# EAGLE schematic Gesamtschaltplan (EAGLE 7.5.0)
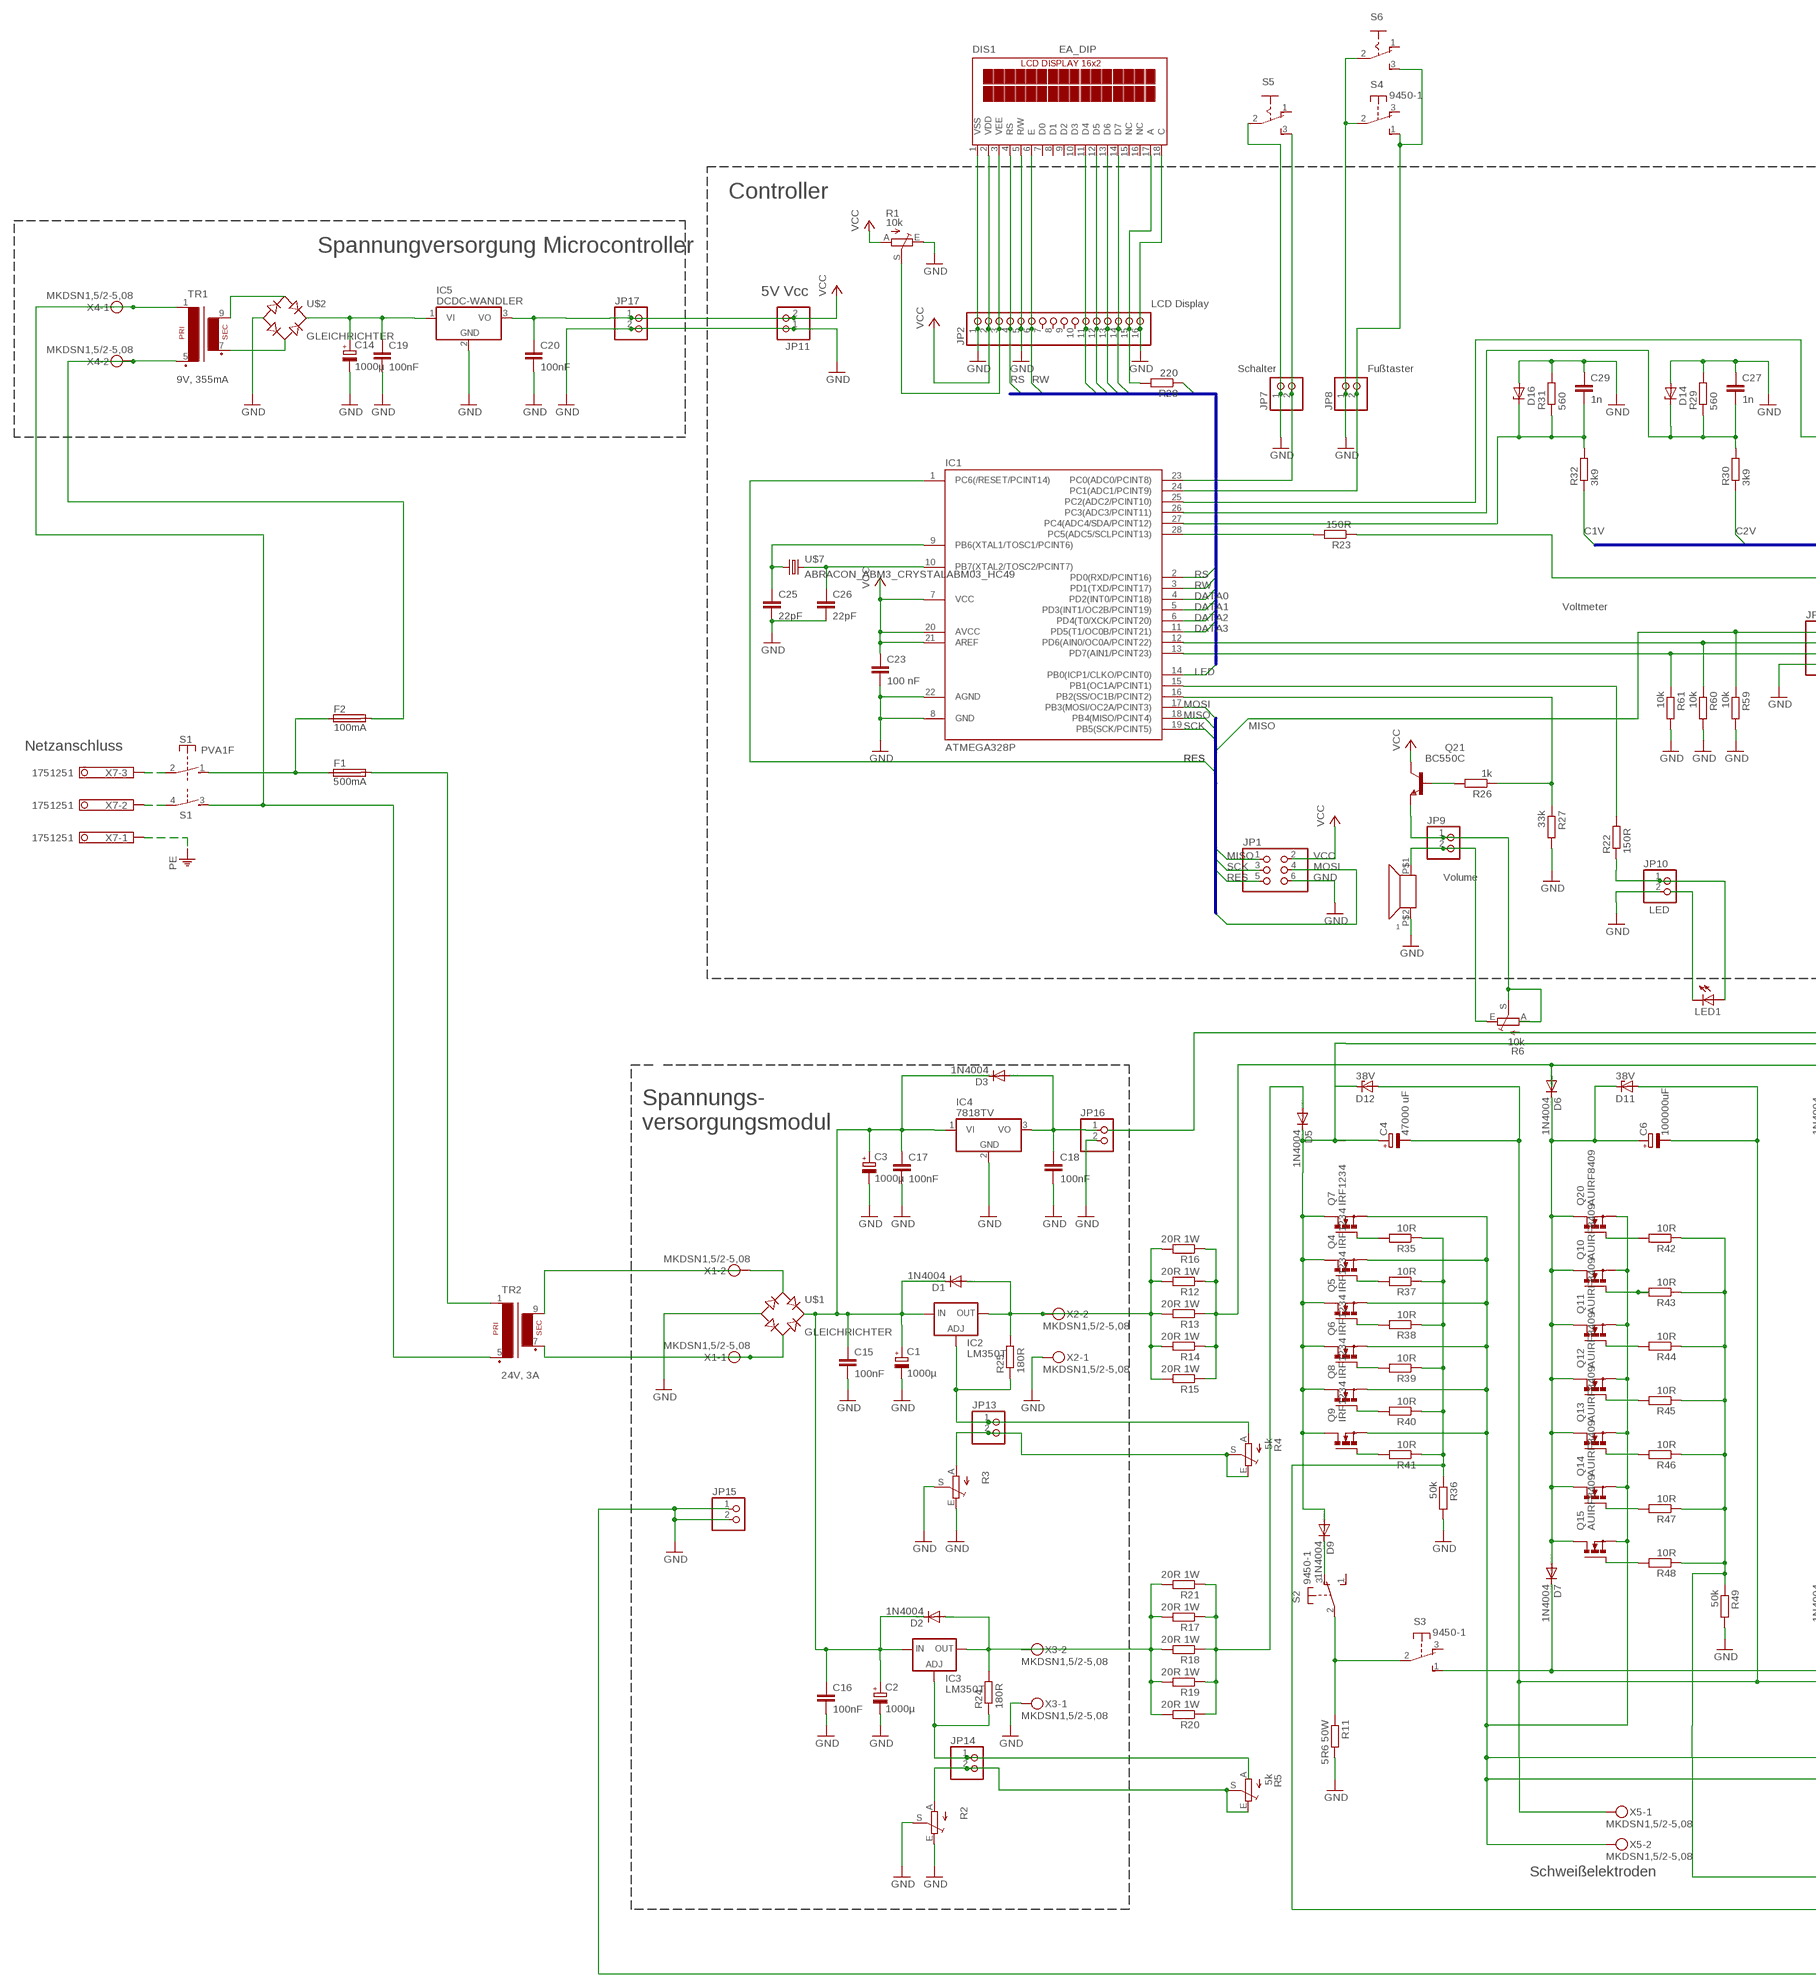
[diagram p0: schematic, sheet 1, part 1 of 2]
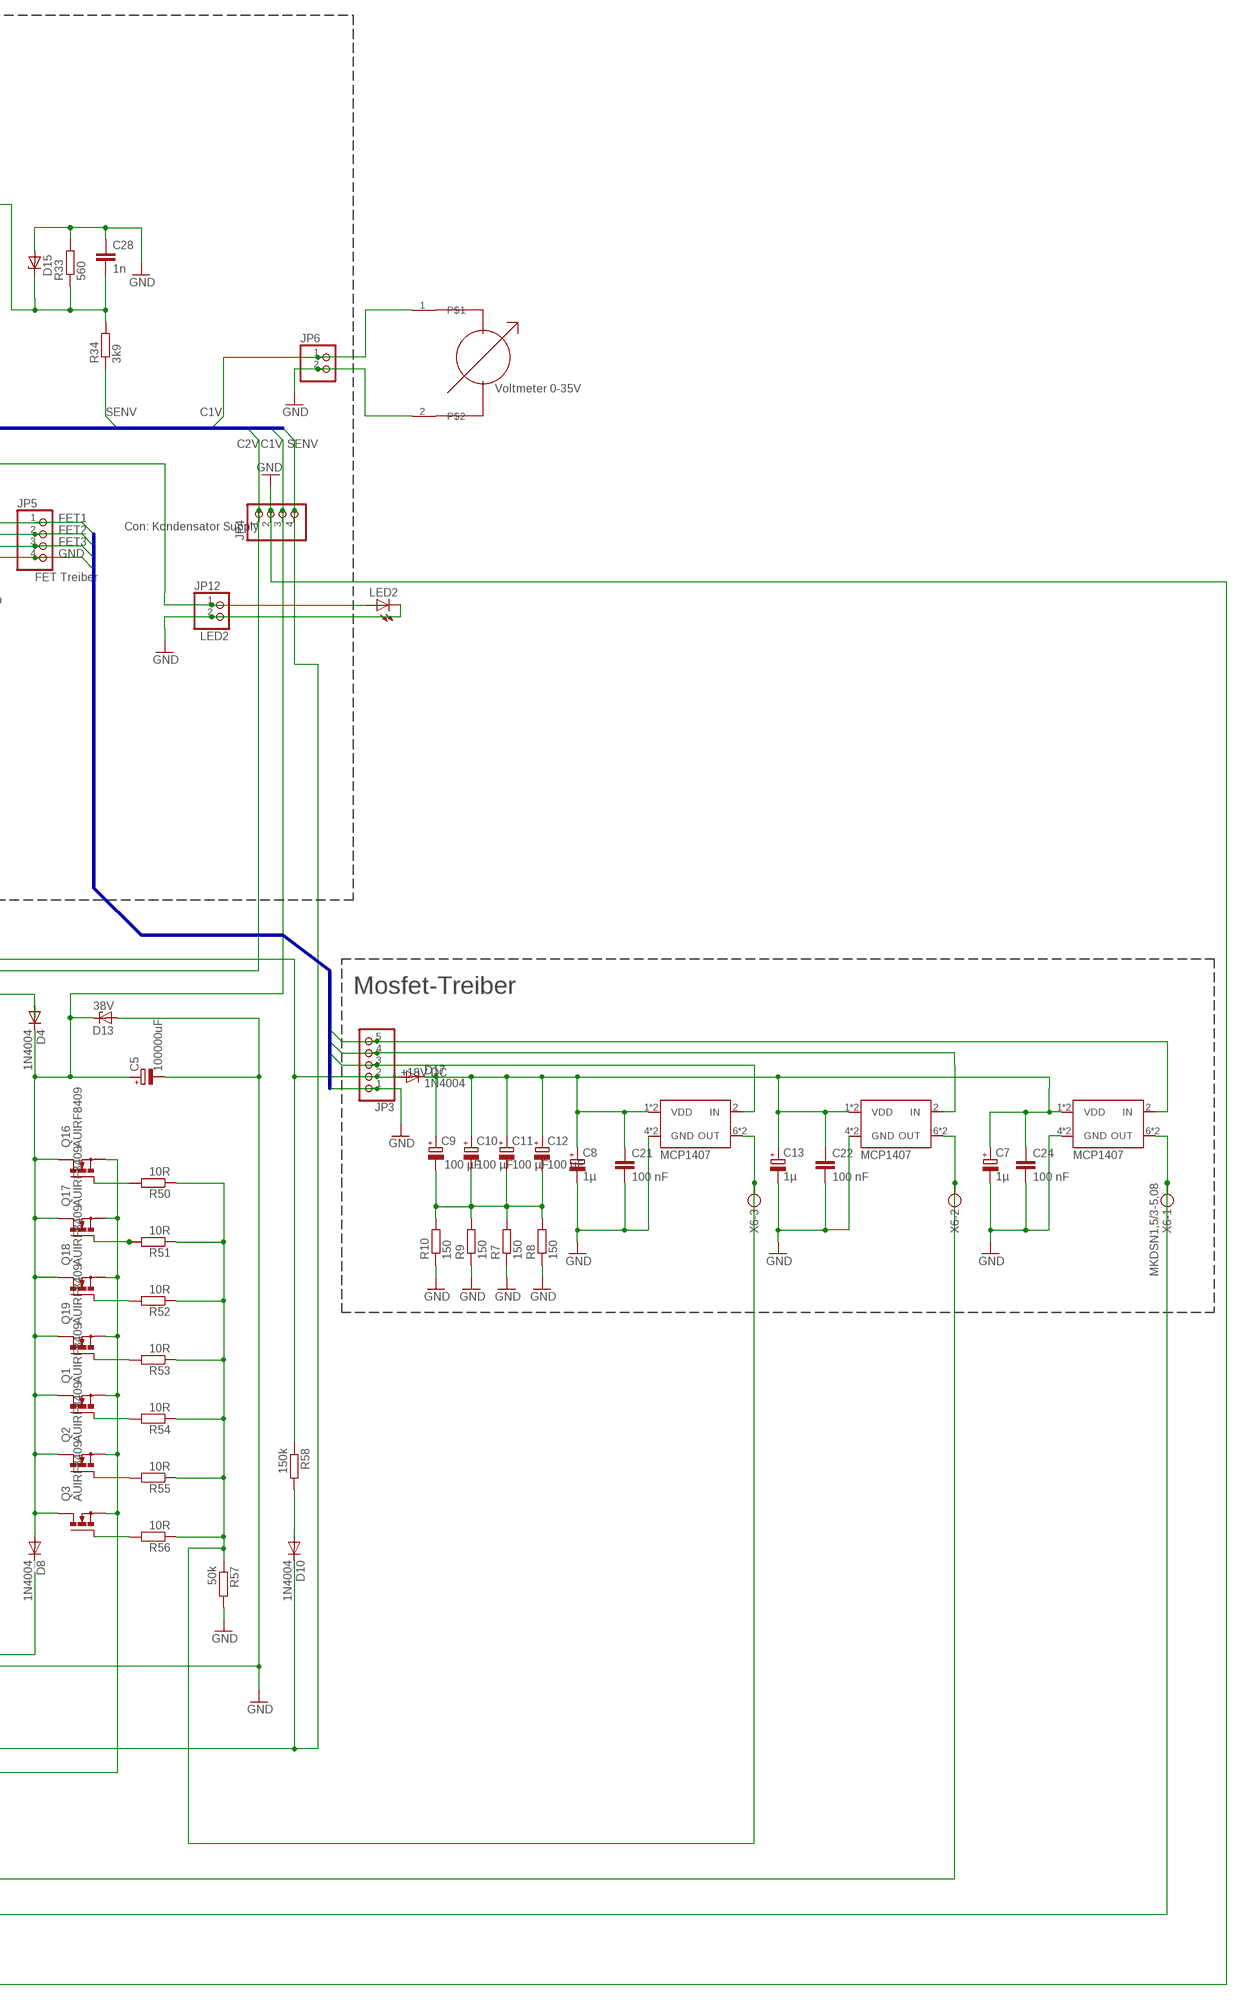
[diagram p1: schematic, sheet 1, part 2 of 2]

## Parts
1  SUMMER4  [PIEZO-INDIKATOR-KPMG]
C1  1000µ  CPOL-EUE5-13  [E5-13]
C2  1000µ  CPOL-EUE5-13  [E5-13]
C3  1000µ  CPOL-EUE5-13  [E5-13]
C4  47000 uF  CPOL-EUE5-9VAXIAL  [E5R]
C5  100000uF  CPOL-EUE5-9VAXIAL  [E5R]
C6  100000uF  CPOL-EUE5-9VAXIAL  [E5R]
C7  1µ  CPOL-EUE5-8.5  [E5-8,5]
C8  1µ  CPOL-EUE5-8.5  [E5-8,5]
C9  100 µF  CPOL-EUE2.5-7  [E2,5-7]
C10  100 µF  CPOL-EUE2.5-7  [E2,5-7]
C11  100 µF  CPOL-EUE2.5-7  [E2,5-7]
C12  100 µF  CPOL-EUE2.5-7  [E2,5-7]
C13  1µ  CPOL-EUE5-8.5  [E5-8,5]
C14  1000µ  CPOL-EUE3.5-8  [E3,5-8]
C15  100nF  C-EUC0805  [C0805]
C16  100nF  C-EUC0805  [C0805]
C17  100nF  C-EUC0805  [C0805]
C18  100nF  C-EUC0805  [C0805]
C19  100nF  C-EUC0805  [C0805]
C20  100nF  C-EUC0805  [C0805]
C21  100 nF  C-EUC0603  [C0603]
C22  100 nF  C-EUC0603  [C0603]
C23  100 nF  C-EUC0603  [C0603]
C24  100 nF  C-EUC0603  [C0603]
C25  22pF  C-EUC0603K  [C0603K]
C26  22pF  C-EUC0603K  [C0603K]
C27  1n  C-EUC0603K  [C0603K]
C28  1n  C-EUC0603K  [C0603K]
C29  1n  C-EUC0603K  [C0603K]
D1  1N4004  [DO41-10]
D2  1N4004  [DO41-10]
D3  1N4004  [DO41-10]
D4  1N4004  [DO41-10]
D5  1N4004  [DO41-10]
D6  1N4004  [DO41-10]
D7  1N4004  [DO41-10]
D8  1N4004  [DO41-10]
D9  1N4004  [DO41-10]
D10  1N4004  [DO41-10]
D11  38V  ZENER-DIODEC1702-15  [C1702-15]
D12  38V  ZENER-DIODEC1702-15  [C1702-15]
D13  38V  ZENER-DIODEC1702-15  [C1702-15]
D14  ZENER-DIODESOT23  [SOT23]
D15  ZENER-DIODESOT23  [SOT23]
D16  ZENER-DIODESOT23  [SOT23]
D17  1N4004  [DO41-10]
DIS1  EA_DIP  [EA_DIP]
F1  500mA  GSH15  [GSH15]
F2  100mA  GSH15  [GSH15]
IC1  ATMEGA328P  MEGA48/88/168-PU  [DIL28-3]
IC2  LM350T  LM317TS  [317TS]
IC3  LM350T  LM317TS  [317TS]
IC4  7818TV  7805TV  [TO220V]
IC5  DCDC-WANDLER  [TRACOPOWER-DCDCWANDER-TSR1]
JP1  PINHD-2X3  [2X03]
JP2  PINHD-1X16  [1X16]
JP3  PINHD-1X5  [1X05]
JP4  PINHD-1X4  [1X04]
JP5  PINHD-1X4  [1X04]
JP6  PINHD-1X2  [1X02]
JP7  PINHD-1X2  [1X02]
JP8  PINHD-1X2  [1X02]
JP9  PINHD-1X2  [1X02]
JP10  PINHD-1X2  [1X02]
JP11  PINHD-1X2  [1X02]
JP12  PINHD-1X2  [1X02]
JP13  PINHD-1X2  [1X02]
JP14  PINHD-1X2  [1X02]
JP15  PINHD-1X2  [1X02]
JP16  PINHD-1X2  [1X02]
JP17  PINHD-1X2  [1X02]
LED1  LED5MM  [LED5MM]
LED2  LED5MM  [LED5MM]
Q1  AUIRF8409  PMOSFET_NTO220BH  [TO220BH]
Q2  AUIRF8409  PMOSFET_NTO220BH  [TO220BH]
Q3  AUIRF8409  PMOSFET_NTO220BH  [TO220BH]
Q4  IRF1234  PMOSFET_NTO220BH  [TO220BH]
Q5  IRF1234  PMOSFET_NTO220BH  [TO220BH]
Q6  IRF1234  PMOSFET_NTO220BH  [TO220BH]
Q7  IRF1234  PMOSFET_NTO220BH  [TO220BH]
Q8  IRF1234  PMOSFET_NTO220BH  [TO220BH]
Q9  IRF1234  PMOSFET_NTO220BH  [TO220BH]
Q10  AUIRF8409  PMOSFET_NTO220BH  [TO220BH]
Q11  AUIRF8409  PMOSFET_NTO220BH  [TO220BH]
Q12  AUIRF8409  PMOSFET_NTO220BH  [TO220BH]
Q13  AUIRF8409  PMOSFET_NTO220BH  [TO220BH]
Q14  AUIRF8409  PMOSFET_NTO220BH  [TO220BH]
Q15  AUIRF8409  PMOSFET_NTO220BH  [TO220BH]
Q16  AUIRF8409  PMOSFET_NTO220BH  [TO220BH]
Q17  AUIRF8409  PMOSFET_NTO220BH  [TO220BH]
Q18  AUIRF8409  PMOSFET_NTO220BH  [TO220BH]
Q19  AUIRF8409  PMOSFET_NTO220BH  [TO220BH]
Q20  AUIRF8409  PMOSFET_NTO220BH  [TO220BH]
Q21  BC550C  [TO92-EBC]
R1  10k  TRIM_EU-PT10  [PT-10]
R2  TRIM_EU-PT10  [PT-10]
R3  TRIM_EU-PT10  [PT-10]
R4  5k  TRIM_EU-PT10  [PT-10]
R5  5k  TRIM_EU-PT10  [PT-10]
R6  10k  TRIM_EU-PT10  [PT-10]
R7  150  R-EU_0411/15  [0411/15]
R8  150  R-EU_0411/15  [0411/15]
R9  150  R-EU_0411/15  [0411/15]
R10  150  R-EU_0411/15  [0411/15]
R11  5R6 50W  R-EU_R1206  [R1206]
R12  20R 1W  R-EU_R1206  [R1206]
R13  20R 1W  R-EU_R1206  [R1206]
R14  20R 1W  R-EU_R1206  [R1206]
R15  20R 1W  R-EU_R1206  [R1206]
R16  20R 1W  R-EU_R1206  [R1206]
R17  20R 1W  R-EU_R1206  [R1206]
R18  20R 1W  R-EU_R1206  [R1206]
R19  20R 1W  R-EU_R1206  [R1206]
R20  20R 1W  R-EU_R1206  [R1206]
R21  20R 1W  R-EU_R1206  [R1206]
R22  150R  R-EU_R1206  [R1206]
R23  150R  R-EU_R1206  [R1206]
R24  180R  R-EU_R1206  [R1206]
R25  180R  R-EU_R1206  [R1206]
R26  1k  R-EU_R1206  [R1206]
R27  33k  R-EU_R1206  [R1206]
R28  220  R-EU_R1206  [R1206]
R29  560  R-EU_R1206  [R1206]
R30  3k9  R-EU_R1206  [R1206]
R31  560  R-EU_R1206  [R1206]
R32  3k9  R-EU_R1206  [R1206]
R33  560  R-EU_R1206  [R1206]
R34  3k9  R-EU_R1206  [R1206]
R35  10R  R-EU_R1206  [R1206]
R36  50k  R-EU_R1206  [R1206]
R37  10R  R-EU_R1206  [R1206]
R38  10R  R-EU_R1206  [R1206]
R39  10R  R-EU_R1206  [R1206]
R40  10R  R-EU_R1206  [R1206]
R41  10R  R-EU_R1206  [R1206]
R42  10R  R-EU_R1206  [R1206]
R43  10R  R-EU_R1206  [R1206]
R44  10R  R-EU_R1206  [R1206]
R45  10R  R-EU_R1206  [R1206]
R46  10R  R-EU_R1206  [R1206]
R47  10R  R-EU_R1206  [R1206]
R48  10R  R-EU_R1206  [R1206]
R49  50k  R-EU_R1206  [R1206]
R50  10R  R-EU_R1206  [R1206]
R51  10R  R-EU_R1206  [R1206]
R52  10R  R-EU_R1206  [R1206]
R53  10R  R-EU_R1206  [R1206]
R54  10R  R-EU_R1206  [R1206]
R55  10R  R-EU_R1206  [R1206]
R56  10R  R-EU_R1206  [R1206]
R57  50k  R-EU_R1206  [R1206]
R58  150k  R-EU_R1206  [R1206]
R59  10k  R-EU_R1206  [R1206]
R60  10k  R-EU_R1206  [R1206]
R61  10k  R-EU_R1206  [R1206]
S1  PVA1F  [PVA1F]
S2  9450-1  [9450-1]
S3  9450-1  [9450-1]
S4  9450-1  [9450-1]
S5  255SB  [255SB]
S6  255SB  [255SB]
TR1  EI38-1  [EI38-1]
TR2  EI38-1  [EI38-1]
U$1  GLEICHRICHTER  [KBPC1]
U$2  GLEICHRICHTER  [KBPC1]
U$3  VOLTMETER  [19560]
U$4  MCP1407MCP1407-DIL08  [DIL-08]
U$5  MCP1407MCP1407-DIL08  [DIL-08]
U$6  MCP1407MCP1407-DIL08  [DIL-08]
U$7  ABRACON_ABM3_CRYSTALABM03_HC49  [ABM03_HC49]
X1  MKDSN1,5/2-5,08  [MKDSN1,5/2-5,08]
X2  MKDSN1,5/2-5,08  [MKDSN1,5/2-5,08]
X3  MKDSN1,5/2-5,08  [MKDSN1,5/2-5,08]
X4  MKDSN1,5/2-5,08  [MKDSN1,5/2-5,08]
X5  MKDSN1,5/2-5,08  [MKDSN1,5/2-5,08]
X6  MKDSN1,5/3-5,08  [MKDSN1,5/3-5,08]
X7  1751251  [1751251]

## Nets
C1V: C5.+ D4.C D8.A D13.C JP4.3 JP6.1 Q1.D Q2.D Q3.D Q16.D Q17.D Q18.D Q19.D R32.1 U$3.1
C1V1: R17.1 R18.1 R19.1 R20.1 R21.1
C2V: JP4.1 R30.1
DATA0: DIS1.11(D4) IC1.4(PD2(INT0/PCINT18)) JP2.11
DATA1: DIS1.12(D5) IC1.5(PD3(INT1/OC2B/PCINT19)) JP2.12
DATA2: DIS1.13(D6) IC1.6(PD4(T0/XCK/PCINT20)) JP2.13
DATA3: DIS1.14(D7) IC1.11(PD5(T1/OC0B/PCINT21)) JP2.14
FET1: JP3.5 U$6.2(IN)
FET2: IC1.12(PD6(AIN0/OC0A/PCINT22)) JP3.4 JP5.2 R60.1 U$5.2(IN)
FET3: IC1.13(PD7(AIN1/PCINT23)) JP3.3 JP5.3 R61.1 U$4.2(IN)
GND: 1.P$2(+) C1.- C2.- C3.- C4.- C5.- C6.- C7.- C8.- C14.- C15.2 C16.2 C17.2 C18.2 C19.2 C20.2 C21.2 C23.2 C24.2 C25.2 C26.2 C27.1 C28.1 C29.1 D11.A D12.A D13.A D14.1(A) D15.1(A) D16.1(A) DIS1.1(VSS) DIS1.5(R/W) DIS1.18(C) IC1.8(GND) IC1.22(AGND) IC4.2(GND) IC5.2(GND) JP1.6 JP2.1 JP2.5 JP2.16 JP3.1 JP4.2 JP5.4 JP6.2 JP7.1 JP8.1 JP10.2 JP11.1 JP12.2 JP15.1 JP15.2 JP16.2 JP17.2 LED2.K(C) R1.E R2.E R2.S R3.E R3.S R7.1 R8.1 R9.1 R10.1 R11.2 R27.2 R29.2 R31.2 R33.2 R36.2 R49.2 R57.2 R59.2 R60.2 R61.2 S5.2(P) S6.2(P) U$1.- U$2.- U$3.2 U$4.4(GND) U$4.5(GND) U$6.4(GND) U$6.5(GND) X2.1 X3.1 X5.1
GND1: C13.- C22.2 U$5.4(GND) U$5.5(GND)
LED: IC1.14(PB0(ICP1/CLKO/PCINT0)) R28.1
MISO: IC1.18(PB4(MISO/PCINT4)) JP1.1 JP5.1 R59.1
MOSI: IC1.17(PB3(MOSI/OC2A/PCINT3)) JP1.4
N$1: JP12.1 LED2.A R23.1
N$2: IC1.28(PC5(ADC5/SCLPCINT13)) R23.2
N$3: D17.A JP3.2 R58.1
N$4: Q21.B R26.2
N$5: C29.2 D16.3(C) IC1.27(PC4(ADC4/SDA/PCINT12)) R31.1 R32.2
N$6: JP10.1 LED1.A R22.1
N$7: C27.2 D14.3(C) IC1.26(PC3(ADC3/PCINT11)) R29.1 R30.2
N$8: DIS1.3(VEE) JP2.3 R1.S
N$9: IC1.16(PB2(SS/OC1B/PCINT2)) R26.1 R27.1
N$10: IC1.23(PC0(ADC0/PCINT8)) JP7.2 S5.3(S)
N$11: LED1.K(C)
N$12: IC1.24(PC1(ADC1/PCINT9)) JP8.2 S4.1(S) S6.3(S)
N$13: 1.P$1(-) JP9.2 R6.E
N$14: D10.A R58.2
N$15: C4.+ D5.C D9.A D12.C Q4.D Q5.D Q6.D Q7.D Q8.D Q9.D
N$16: C9.- C10.- C11.- C12.- R7.2 R8.2 R9.2 R10.2
N$17: D5.A
N$18: C28.2 D15.3(C) IC1.25(PC2(ADC2/PCINT10)) R33.1 R34.2
N$19: S3.1(S)
N$20: IC2.1(ADJ) JP13.1 R4.A R25.1
N$21: D4.A D6.A R12.1 R13.1 R14.1 R15.1 R16.1
N$22: JP9.1 Q21.E R6.A R6.S
N$23: JP14.2 R2.A R5.E R5.S
N$24: U$1.AC1 X1.2
N$25: TR2.7(S3) U$1.AC2 X1.1
N$26: IC1.15(PB1(OC1A/PCINT1)) R22.2
N$27: C26.1 IC1.10(PB7(XTAL2/TOSC2/PCINT7)) U$7.2
N$28: C25.1 IC1.9(PB6(XTAL1/TOSC1/PCINT6)) U$7.1
N$29: JP13.2 R3.A R4.E R4.S
N$30: R11.1 S2.2(P) S3.2(P)
N$31: C7.+ C8.+ C9.+ C10.+ C11.+ C12.+ C13.+ C21.1 C22.1 C24.1 D17.C U$4.1(VDD) U$4.8(VDD) U$5.1(VDD) U$5.8(VDD) U$6.1(VDD) U$6.8(VDD)
N$35: D9.C S2.3(O)
N$36: C1.+ C2.+ C3.+ C15.1 C16.1 C17.1 D1.C D2.C D3.C IC2.3(IN) IC3.3(IN) IC4.1(VI) U$1.+
N$37: C18.1 D3.A IC4.3(VO) JP16.1
N$38: C14.+ C19.1 IC5.1(VI) U$2.+
N$39: S1.3(2:S) TR1.1 TR2.5(P2) X4.1
N$40: F2.2 TR1.5(P2) X4.2
N$41: TR1.7(S3) U$2.AC2
N$42: TR1.9(S4) U$2.AC1
N$43: Q7.G R35.2
N$44: Q4.G R37.2
N$45: Q5.G R38.2
N$46: S1.4(2:P) X7.2
N$47: DIS1.17(A) JP2.15 R28.2
N$48: TR2.9(S4)
N$49: S1.2(1:P) X7.3
N$50: F1.1 F2.1 S1.1(1:S)
N$51: F1.2 TR2.1
N$52: Q6.G R39.2
N$53: Q8.G R40.2
N$54: Q9.G R41.2
N$55: R35.1 R36.1 R37.1 R38.1 R39.1 R40.1 R41.1 U$6.6(OUT) U$6.7(OUT) X6.1
N$56: R17.2 R18.2 R19.2 R20.2 R21.2
N$57: D1.A IC2.2(OUT) R12.2 R13.2 R14.2 R15.2 R16.2 R25.2 X2.2
N$59: IC3.1(ADJ) JP14.1 R24.1
N$60: D2.A IC3.2(OUT) R24.2 X3.2
N$61: Q20.G R42.2
N$62: Q10.G R43.2
N$63: Q11.G R44.2
N$64: Q12.G R45.2
N$65: Q13.G R46.2
N$66: Q14.G R47.2
N$67: Q15.G R48.2
N$68: R42.1 R43.1 R44.1 R45.1 R46.1 R47.1 R48.1 R49.1 U$5.6(OUT) U$5.7(OUT) X6.2
N$69: C6.+ D6.C D7.A D11.C Q10.D Q11.D Q12.D Q13.D Q14.D Q15.D Q20.D
N$70: Q16.G R50.2
N$71: Q17.G R51.2
N$72: Q18.G R52.2
N$73: Q19.G R53.2
N$74: Q1.G R54.2
N$75: Q2.G R55.2
N$76: Q3.G R56.2
N$77: R50.1 R51.1 R52.1 R53.1 R54.1 R55.1 R56.1 R57.1 U$4.6(OUT) U$4.7(OUT) X6.3
PE: X7.1
RES: IC1.1(PC6(/RESET/PCINT14)) JP1.5
RS: DIS1.4(RS) IC1.2(PD0(RXD/PCINT16)) JP2.4
RW: DIS1.6(E) IC1.3(PD1(TXD/PCINT17)) JP2.6
SCK: IC1.19(PB5(SCK/PCINT5)) JP1.3
SENV: D10.C JP4.4 Q1.S Q2.S Q3.S Q4.S Q5.S Q6.S Q7.S Q8.S Q9.S Q10.S Q11.S Q12.S Q13.S Q14.S Q15.S Q16.S Q17.S Q18.S Q19.S Q20.S R34.1 X5.2
VCC: C20.1 C23.1 DIS1.2(VDD) IC1.7(VCC) IC1.20(AVCC) IC1.21(AREF) IC5.3(VO) JP1.2 JP2.2 JP11.2 JP17.1 Q21.C R1.A
Unconnected: D7.C D8.C DIS1.7(D0) DIS1.8(D1) DIS1.9(D2) DIS1.10(D3) DIS1.15(NC) DIS1.16(NC) JP2.7 JP2.8 JP2.9 JP2.10 R5.A S2.1(S) S3.3(O) S4.2(P) S4.3(O) S5.1(O) S6.1(O)

## Buses
DISPLAY:DATA[0..3],RS,RW,LED
ISP:MISO,MOSI,SCK,RES
VOLTAGEMEASURES:C1V,C2V,SENV
FET[1..3],GND

## Notes on the sheet
- Controller
- Spannungversorgung Microcontroller
- 5V Vcc
- LCD Display
- Schalter | Fußtaster
- 9V, 355mA
- Voltmeter 0-35V
- Voltmeter
- FET1 | Con: Kondensator Supply
- FET Treiber
- LED2
- Netzanschluss
- Volume
- LED
- Mosfet-Treiber
- Spannungs-
  versorgungsmodul
- +18V DC
- MCP1407 | MCP1407 | MCP1407
- 24V, 3A
- Schweißelektroden

## Library data of the parts
1 = 0liver:SUMMER: SUMMER BS 27HS :: Piezosummer https://www.reichelt.de/Signalakustik/SUMMER-BS-27HS/3/index.html?&ACTION=3&LA=446&GROUPID=6560&ARTICLE=35922
C1-C14 = rcl:CPOL-EU: POLARIZED CAPACITOR, European symbol
C15-C20 C27-C29 = rcl:C-EU: CAPACITOR, European symbol
C21-C26 = resistor:C-EU: CAPACITOR, European symbol
D1-D10 D17 = diode:1N4004: DIODE general purpose rectifier, 1 A
D11-D16 = diode:ZENER-DIODE: Z-Diode
DIS1 = display-lcd:EA_DIP: LCD-MODUL 2x16 - 6,68mm, INKL. KONTROLLER HD44780 Source: Data sheet <http://www.lcd-module.de/pdf/doma/dip162-d.pdf>
F1 F2 = fuse:GSH15: FUSE HOLDER grid 15mm, 19649 Wickmann; MPN: 64900001039; OC_FARNELL: 1271673; OC_NEWARK: 02P0318
IC1 = avr-6:MEGA48/88/168-PU
IC2 IC3 = v-reg:LM317TS: VOLTAGE REGULATOR
IC4 = linear:78*: Positive VOLTAGE REGULATOR Source: http://cache.national.com/ds/LM/LM78L05.pdf http://www.fairchildsemi.com/ds/LM/LM7805.pdf
IC5 = 0liver:DCDC-WANDLER
JP1 = pinhead:PINHD-2X3: PIN HEADER
JP2 = pinhead:PINHD-1X16: PIN HEADER
JP3 = pinhead:PINHD-1X5: PIN HEADER
JP4 JP5 = pinhead:PINHD-1X4: PIN HEADER
JP6-JP17 = pinhead:PINHD-1X2: PIN HEADER
LED1 LED2 = led:LED: LED OSRAM: - CHIPLED LG R971, LG N971, LY N971, LG Q971, LY Q971, LO R971, LY R971 LH N974, LH R974 LS Q976, LO Q976, LY Q976 LO Q996 - Hyper CHIPLED LW Q18S LB Q993, LB Q99A, LB R99A - SideLED LS A670, LO A670, LY A670, LG A670, LP A670 LB A673, LV A673, LT A673, LW A673 LH A674 LY A675 LS A676, LA A676, LO A676, LY A676, LW A676 LS A679, LY A679, LG A679 - Hyper Micro SIDELED® LS Y876, LA Y876, LO Y876, LY Y876 LT Y87S - SmartLED LW L88C, LW L88S LB L89C, LB L89S, LG L890 LS L89K, LO L89K, LY L89K LS L896, LA L896, LO L896, LY L896 - TOPLED LS T670, LO T670, LY T670, LG T670, LP T670 LSG T670, LSP T670, LSY T670, LOP T670, LYG T670 LG T671, LOG T671, LSG T671 LB T673, LV T673, LT T673, LW T673 LH T674 LS T676, LA T676, LO T676, LY T676, LB T676, LH T676, LSB T676, LW T676 LB T67C, LV T67C, LT T67C, LS T67K, LO T67K, LY T67K, LW E67C LS E67B, LA E67B, LO E67B, LY E67B, LB E67C, LV E67C, LT E67C LW T67C LS T679, LY T679, LG T679 LS T770, LO T770, LY T770, LG T770, LP T770 LB T773, LV T773, LT T773, LW T773 LH T774 LS E675, LA E675, LY E675, LS T675 LS T776, LA T776, LO T776, LY T776, LB T776 LHGB T686 LT T68C, LB T68C - Hyper Mini TOPLED® LB M676 - Mini TOPLED Santana® LG M470 LS M47K, LO M47K, LY M47K Source: http://www.osram.convergy.de LUXEON: - LUMILED® LXK2-PW12-R00, LXK2-PW12-S00, LXK2-PW14-U00, LXK2-PW14-V00 LXK2-PM12-R00, LXK2-PM12-S00, LXK2-PM14-U00 LXK2-PE12-Q00, LXK2-PE12-R00, LXK2-PE12-S00, LXK2-PE14-T00, LXK2-PE14-U00 LXK2-PB12-K00, LXK2-PB12-L00, LXK2-PB12-M00, LXK2-PB14-N00, LXK2-PB14-P00, LXK2-PB14-Q00 LXK2-PR12-L00, LXK2-PR12-M00, LXK2-PR14-Q00, LXK2-PR14-R00 LXK2-PD12-Q00, LXK2-PD12-R00, LXK2-PD12-S00 LXK2-PH12-R00, LXK2-PH12-S00 LXK2-PL12-P00, LXK2-PL12-Q00, LXK2-PL12-R00 Source: www.luxeon.com KINGBRIGHT: KA-3528ASYC Source: www.kingbright.com
Q1-Q20 = transistor-power:PMOSFET_N: Power MOSFET N-Channel
Q21 = transistor-npn:BC550*: NPN Transistor
R1-R6 = pot:TRIM_EU-: POTENTIOMETER
R7-R10 R26-R34 R59-R61 = resistor:R-EU_: RESISTOR, European symbol
R11-R25 R35-R58 = rcl:R-EU_: RESISTOR, European symbol
S1 = switch-misc:PVA1: ITT SWITCH
S2-S4 = switch-misc:9450-1: MARQUARDT SWITCH
S5 S6 = switch:255SB: SLIDING SWITCH Distributor Buerklin, 11G810
TR1 TR2 = trafo:EI38-1: TRANSFORMER 1 primary winding, 1 secondary winding ERA
U$1 U$2 = Gleichrichter:GLEICHRICHTER
U$3 = 0liver:VOLTMETER
U$4-U$6 = 0liver:MCP1407
U$7 = Ava:ABRACON_ABM3_CRYSTAL
X1-X5 = con-phoenix-508:MKDSN1,5/2-5,08: MKDSN 1,5/ 2-5,08 Printklemme Nennstrom: 13,5 A Nennspannung: 250 V Rastermaß: 5,08 mm Polzahl: 2 Anschlussart: Schraubanschluss Montage: Löten Anschlussrichtung Leiter/Platine: 0 ° Artikelnummer: 1729128 Source: http://eshop.phoenixcontact.com .. 1729128.pdf
X6 = con-phoenix-508:MKDSN1,5/3-5,08: MKDSN 1,5/ 3-5,08 Printklemme Nennstrom: 13,5 A Nennspannung: 250 V Rastermaß: 5,08 mm Polzahl: 3 Anschlussart: Schraubanschluss Montage: Löten Anschlussrichtung Leiter/Platine: 0 ° Artikelnummer: 1729131 Source: http://eshop.phoenixcontact.com .. 1729131.pdf
X7 = con-phoenix-350:1751251: MKDS 1/ 3-3,5 Printklemme Nennstrom: 10 A Bemessungsspannung: 160 V Raster: 3,5 mm Polzahl: 3 Montageart: Löten Anschlussart: Schraubanschluss Anschlussrichtung vom Leiter zur Platine: 0° Source: http://eshop.phoenixcontact.com .. 1751251.pdf; OC_FARNELL: unknown; OC_NEWARK: unknown